# EAGLE design VGA_Test_Board (EAGLE 8.5.0)
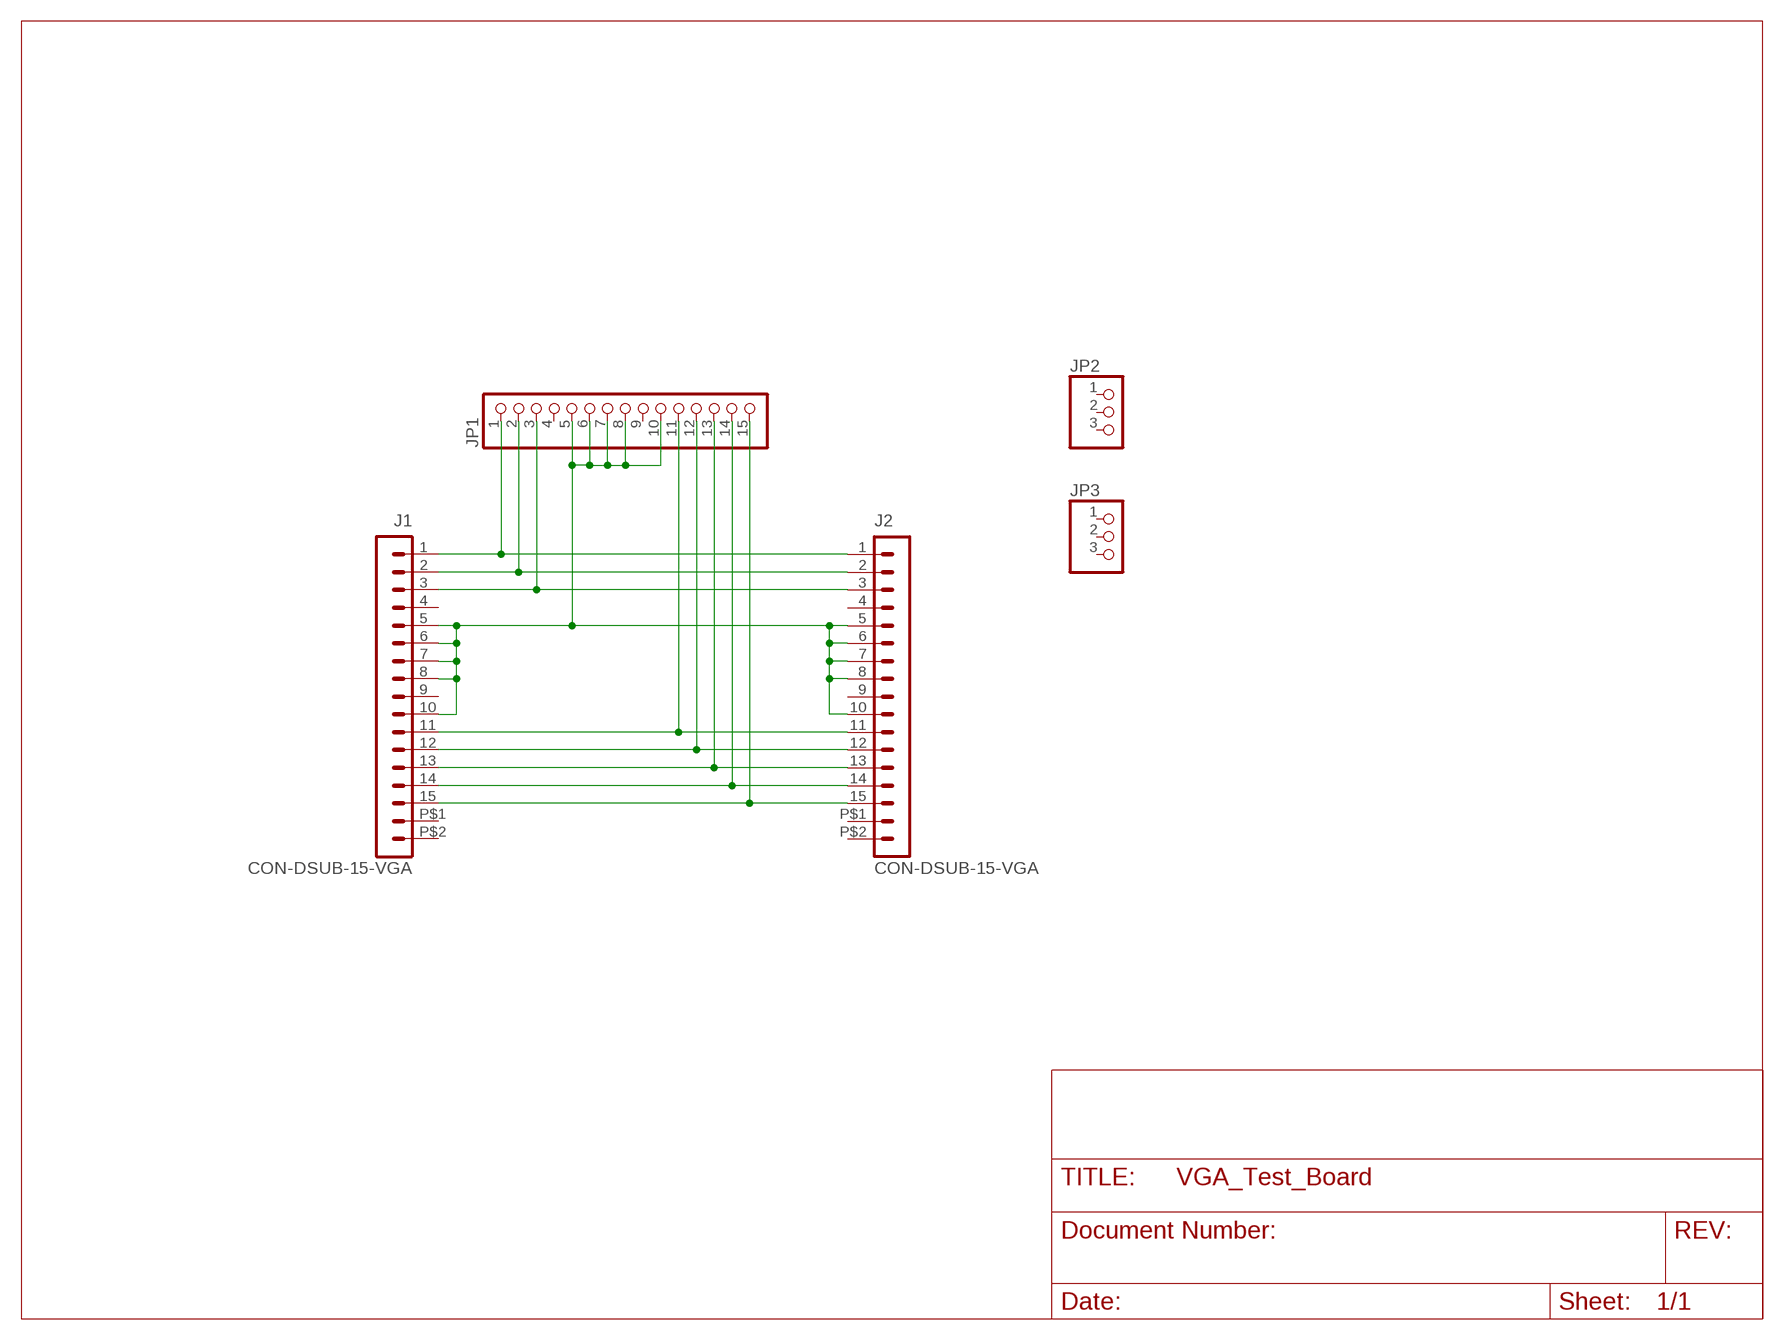
[diagram p0: schematic, sheet 1]

## Parts
J1  CON-DSUB-15-VGA  [181-015-212-171]
J2  CON-DSUB-15-VGA  [181-015-212-171]
JP1  PINHD-1X15  [1X15]
JP2  PINHD-1X3  [1X03]
JP3  PINHD-1X3  [1X03]

## Nets
GND: J1.5 J1.6 J1.7 J1.8 J1.10 J2.5 J2.6 J2.7 J2.8 J2.10 JP1.5 JP1.6 JP1.7 JP1.8 JP1.10
N$1: J1.1 J2.1 JP1.1
N$2: J1.2 J2.2 JP1.2
N$3: J1.3 J2.3 JP1.3
N$11: J1.11 J2.11 JP1.11
N$12: J1.12 J2.12 JP1.12
N$13: J1.13 J2.13 JP1.13
N$14: J1.14 J2.14 JP1.14
N$15: J1.15 J2.15 JP1.15
Unconnected: J1.4 J1.9 J1.P$1 J1.P$2 J2.4 J2.9 J2.P$1 J2.P$2 JP1.4 JP1.9 JP2.1 JP2.2 JP2.3 JP3.1 JP3.2 JP3.3

## Library data of the parts
J1 J2 = m-pad-2.1:CON-DSUB-15-VGA: NORCOMP's High Density 90° PC Mount D-Sub Connector 181 Series: SPECIFICATIONS: Contact Rating: 5 Amps Dielectric Strength: 1000V AC RMS Insulation Resistance: 1000 meg ohms Contact Material: Phosphor Bronze Contact Finish: Gold flash over Nickel Operating Temperature: -55°C to 150°C Shell Material: Steel, Tin Plated Insulations Material: Glass-Filled Polyester (UL94V-0) Gender: Receptacle (female) Please send any comments to: messi@users.sourceforge.net
JP1 = pinhead:PINHD-1X15: PIN HEADER
JP2 JP3 = pinhead:PINHD-1X3: PIN HEADER

## Board
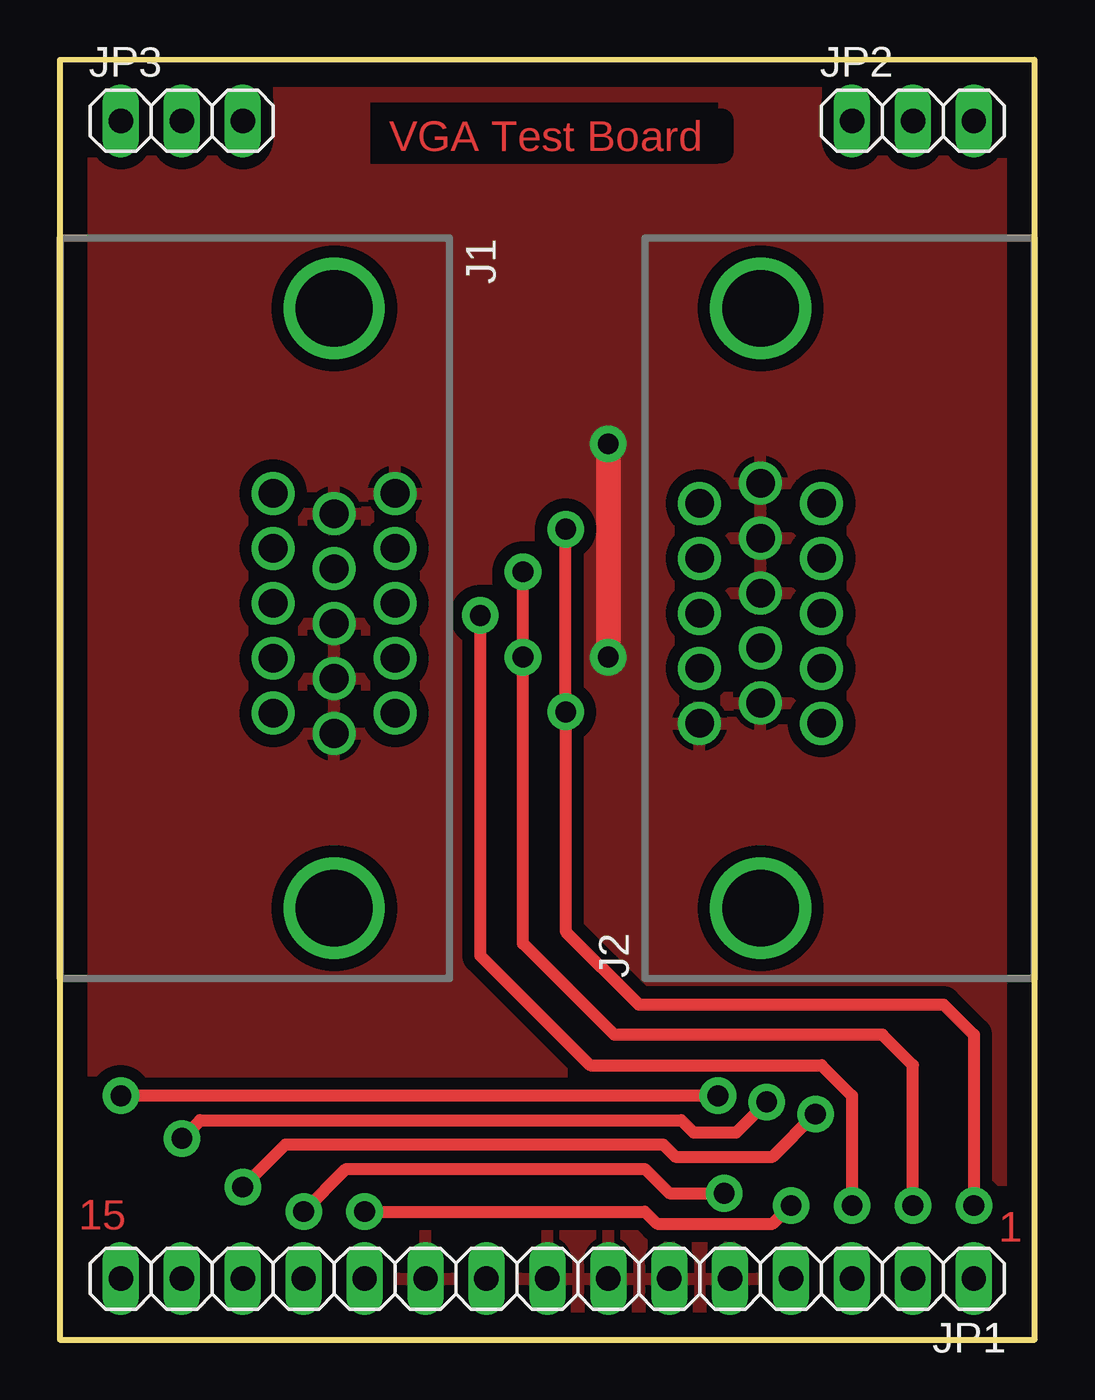
[diagram p1: board, top side]
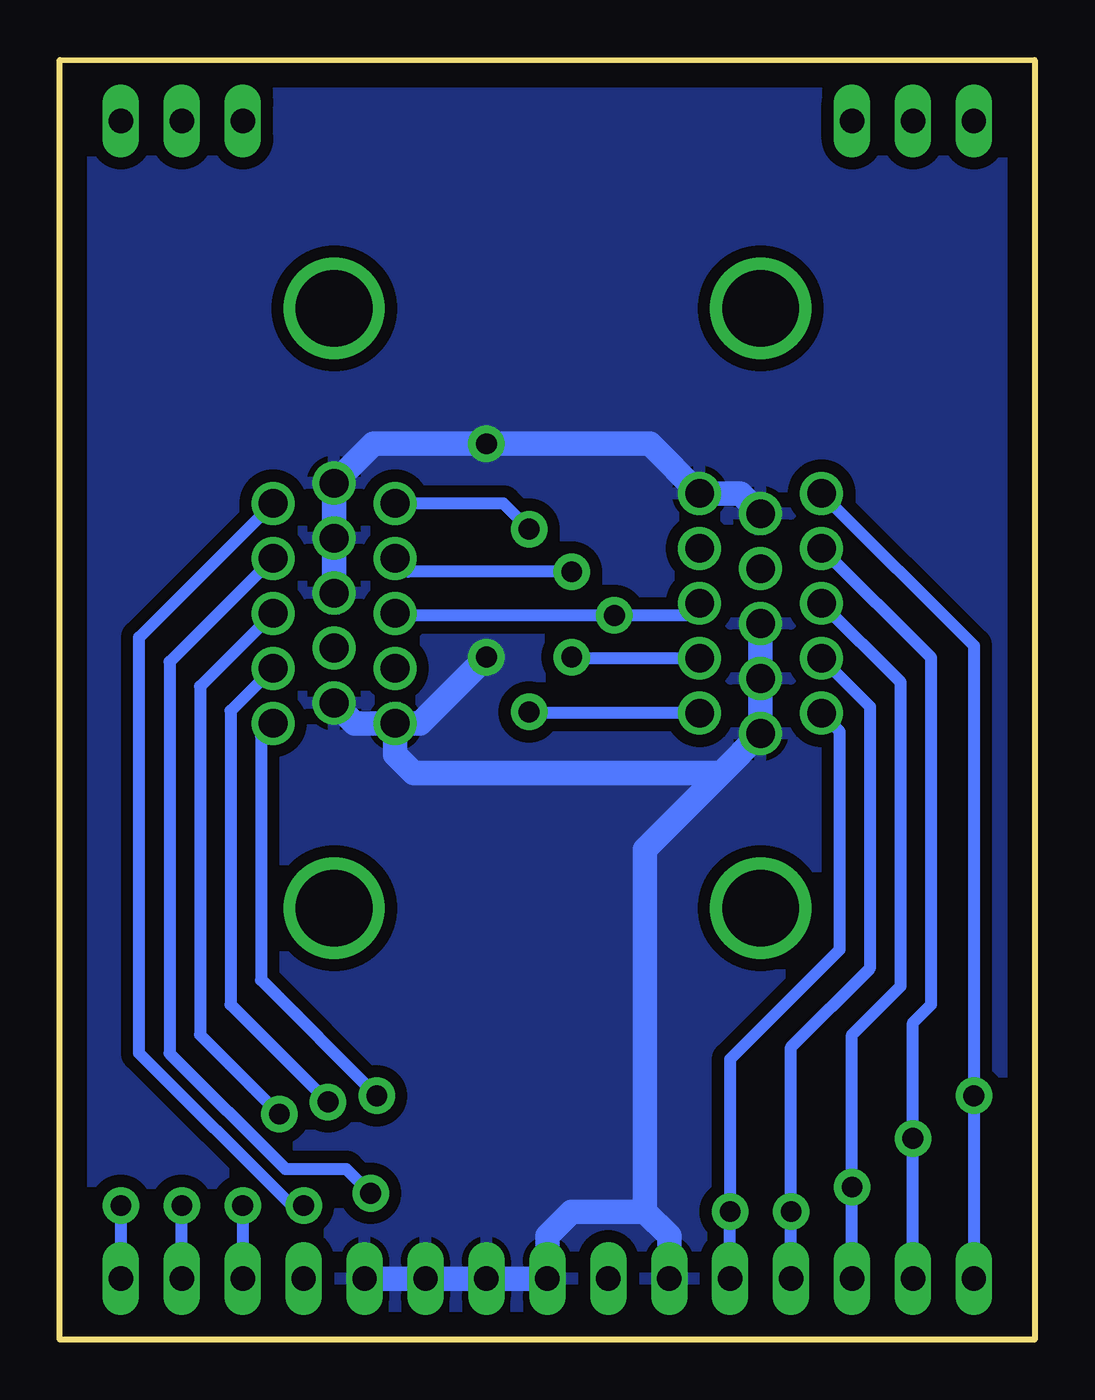
[diagram p2: board, bottom side, seen from below]

Size 40.64 x 53.34 mm. Coordinates in mm from the lower left corner, seen from the top.
Outline: 0,0 40.64,0 40.64,53.34 0,53.33 0,0
Copper layers (1*16): Top 0.035mm / dielectric 1.5mm / Bottom 0.035mm
Design rules "DRCmasse": minimum track width 20mil, minimum drill 1mil, track to track 20mil, track to pad 50mil, pad to pad 10mil, via to via 10mil, smd to smd 8mil, copper to edge 40mil, drill to drill 8mil, minimum pad ring 10mil, minimum via ring 8mil, stop-mask expansion 0mil, vias tented up to drill 0mil, thermal gap 10mil
tRestrict: area 13,49 to 27.4,51.6

### Footprints (pad centres in the part's own frame; a part is rotated, then mirrored left to right if it is on the bottom)
181-015-212-171 = drill 1.194: 1 4.371,2.541; 2 2.08,2.541; 3 -0.211,2.541; 4 -2.502,2.541; 5 -4.793,2.541; 6 5.217,0; 7 2.926,0; 8 0.635,0; 9 -1.656,0; 10 -3.947,0; 11 4.371,-2.541; 12 2.08,-2.541; 13 -0.211,-2.541; 14 -2.502,-2.541; 15 -4.793,-2.541 | drill 3.2: P$1 -12.502,0; P$2 12.502,0
1X15 = drill 1.016 long: 1 -17.78,0; 2 -15.24,0; 3 -12.7,0; 4 -10.16,0; 5 -7.62,0; 6 -5.08,0; 7 -2.54,0; 8 0,0; 9 2.54,0; 10 5.08,0; 11 7.62,0; 12 10.16,0; 13 12.7,0; 14 15.24,0; 15 17.78,0
1X03 = drill 1.016 long: 1 -2.54,0; 2 0,0; 3 2.54,0

### Placement (x,y rotation side)
J1  11.43,30.48 270 top
J2  29.21,30.48 90 top
JP1  20.32,2.54 180 top
JP2  35.56,50.8 0 top
JP3  5.08,50.8 0 top

### Tracks (layer width: path | path; a pad name or v marks a point on that pad's centre or on a via)
GND  (via drill 0.86 pad 1.52)
  Top 1.016: v22.86,28.45 v22.86,37.34
  Bottom 1.016: J1.8 J1.7 J1.6 13.07,23.62 | J1.10 12.28,35.27 J1.5 16.04,37.34 v22.86,37.34 27.57,37.34 J2.6 J2.7 J2.8 | J2.10 28.36,25.69 J2.5 | JP1.10 15.24,4.32 16.26,5.33 | JP1.5 JP1.6 JP1.7 JP1.8 20.32,4.32 19.3,5.33 16.26,5.33 | J2.5 25.62,25.69 v22.86,28.45 | J2.5 26.67,24.39 26.67,24.38 25.91,23.62 13.07,23.62 | 16.26,5.33 16.26,20.44 13.07,23.62
  pour Bottom: 0.25,53.09 40.39,53.09 40.39,0.25 0.25,0.25
  pour Top: 0.25,53.09 40.39,53.09 40.39,0.25 0.25,0.25
N$1  (via drill 0.86 pad 1.52)
  Top 0.508: v38.1,5.59 38.1,12.7 36.83,13.97 24.13,13.97 21.08,17.02 v21.08,26.16 v21.08,33.78
  Bottom 0.508: v38.1,5.59 JP1.1 | J1.1 21.03,26.11 v21.08,26.16 | v21.08,33.78 22.15,34.85 J2.1
N$2  (via drill 0.86 pad 1.52)
  Top 0.508: v35.56,5.59 35.56,11.43 34.29,12.7 23.11,12.7 19.3,16.51 v19.3,28.45 v19.3,32
  Bottom 0.508: JP1.2 v35.56,5.59 | v19.3,32 26.11,32 J2.2 | v19.3,28.45 19.26,28.4 J1.2
N$3  (via drill 0.86 pad 1.52)
  Top 0.508: v17.53,30.18 17.53,16 22.1,11.43 31.75,11.43 33.02,10.16 v33.02,5.59
  Bottom 0.508: J1.3 14.48,30.18 v17.53,30.18 26.58,30.18 J2.3 | v33.02,5.59 JP1.3
N$11  (via drill 0.86 pad 1.52)
  Top 0.508: v12.7,5.33 24.38,5.33 24.89,4.83 29.72,4.83 v30.48,5.59
  Bottom 0.508: JP1.11 v12.7,5.33 12.7,11.68 8.13,16.26 8.13,25.14 8.13,25.35 J1.11 | v30.48,5.59 30.99,5.59 37.34,11.94 37.34,29.27 J2.11
N$12  (via drill 0.86 pad 1.52)
  Top 0.508: v27.69,6.1 25.4,6.1 24.38,7.11 11.94,7.11 v10.16,5.33
  Bottom 0.508: JP1.12 v10.16,5.33 10.16,12.19 6.86,15.49 6.86,26.37 J1.12 | J2.12 36.07,28.24 36.07,11.94 31.24,7.11 28.7,7.11 v27.69,6.1
N$13  (via drill 0.86 pad 1.52)
  Top 0.508: v31.5,9.4 29.72,7.62 25.65,7.62 25.15,8.13 9.4,8.13 v7.62,6.35
  Bottom 0.508: JP1.13 v7.62,6.35 7.62,12.7 5.59,14.73 5.59,27.39 J1.13 | J2.13 34.8,27.22 34.8,12.7 v31.5,9.4
N$14  (via drill 0.86 pad 1.52)
  Top 0.508: v29.46,9.91 28.19,8.64 26.42,8.64 25.91,9.14 5.84,9.14 v5.08,8.38
  Bottom 0.508: JP1.14 v5.08,8.38 5.08,13.21 4.32,13.97 4.32,28.41 J1.14 | J2.14 33.53,26.2 33.53,13.97 v29.46,9.91
N$15  (via drill 0.86 pad 1.52)
  Top 0.508: v27.43,10.16 v2.54,10.16
  Bottom 0.508: J1.15 2.54,28.92 v2.54,10.16 JP1.15 | J2.15 32.26,25.18 32.26,14.99 v27.43,10.16

### Text on the board
Top: VGA Test Board | 15 | 1